# Altium schematic sheet MemoryStorage.SchDoc
size A4; SheetNumber: 7; SheetTotal: 12
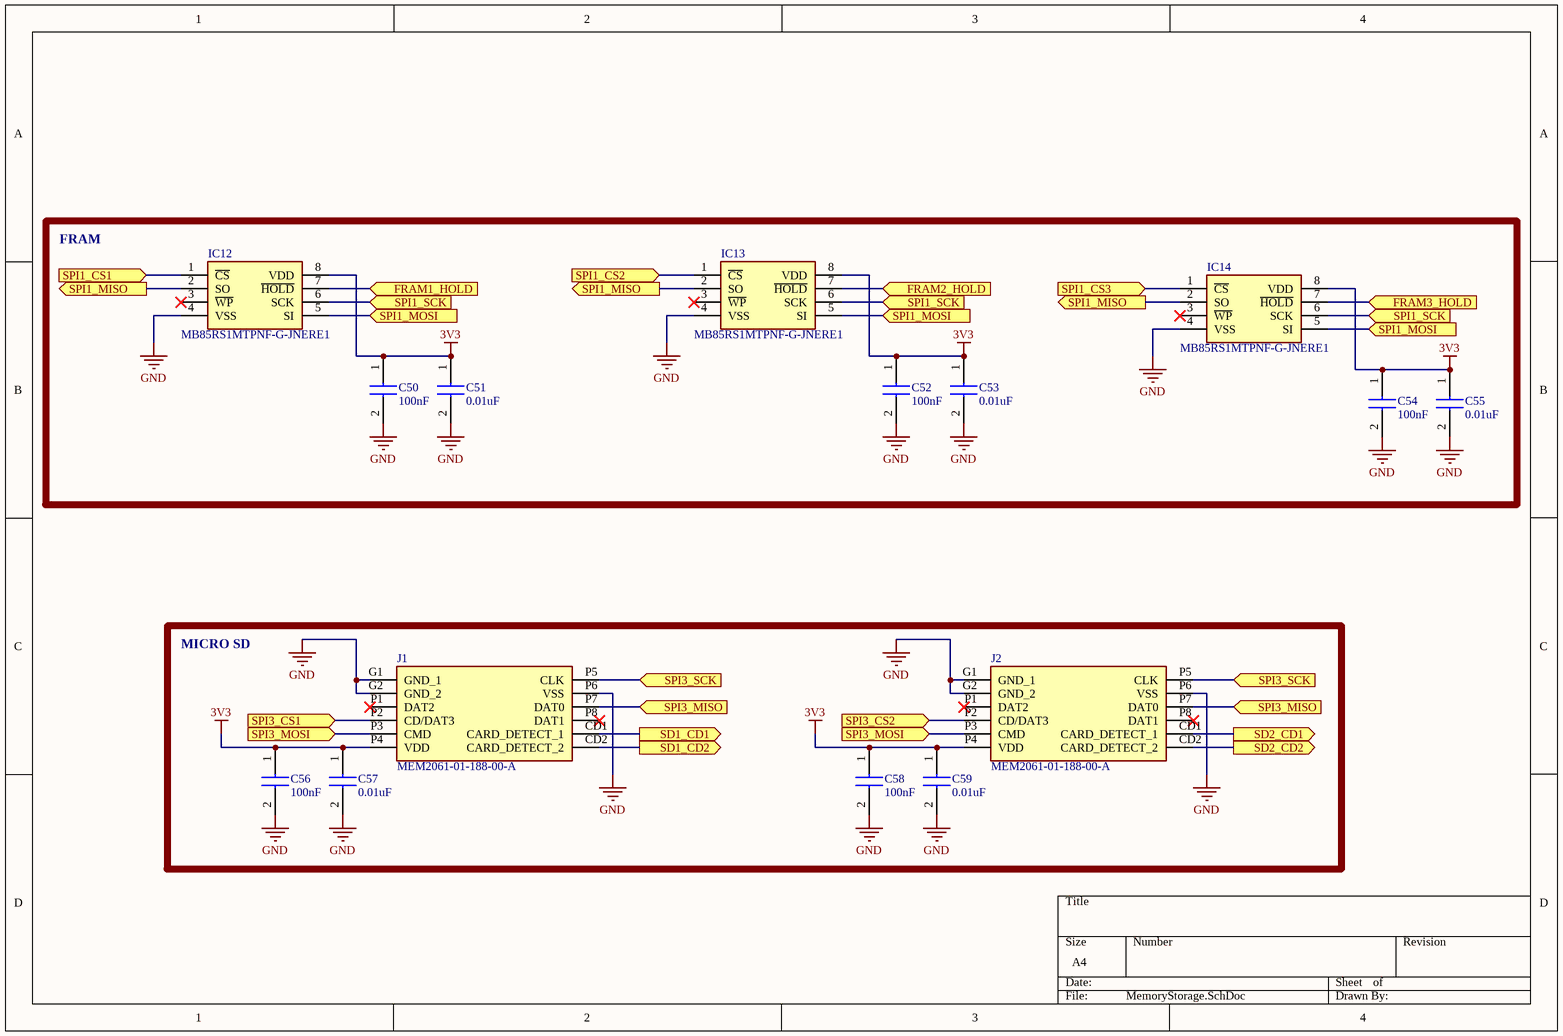
[diagram p0: MemoryStorage.SchDoc]

## Parts
C50  100nF  [CAPC1608X95N]
C51  0.01uF  [C0603]
C52  100nF  [CAPC1608X95N]
C53  0.01uF  [C0603]
C54  100nF  [CAPC1608X95N]
C55  0.01uF  [C0603]
C56  100nF  [CAPC1608X95N]
C57  0.01uF  [C0603]
C58  100nF  [CAPC1608X95N]
C59  0.01uF  [C0603]
IC12  MB85RS1MTPNF-G-JNERE1  [SOIC127P600X175-8N]
IC13  MB85RS1MTPNF-G-JNERE1  [SOIC127P600X175-8N]
IC14  MB85RS1MTPNF-G-JNERE1  [SOIC127P600X175-8N]
J1  MEM2061-01-188-00-A  [MEM20610118800A]
J2  MEM2061-01-188-00-A  [MEM20610118800A]

## Blocks framed on the sheet
FRAM: C50-C55 IC12-IC14
MICRO SD: C56-C59 J1 J2

## Ports
FRAM1_HOLD (in), FRAM2_HOLD (in), FRAM3_HOLD (in), SD1_CD1 (out), SD1_CD2 (out), SD2_CD1 (out), SD2_CD2 (out), SPI1_CS1 (in), SPI1_CS2 (in), SPI1_CS3 (in), SPI1_MISO (out), SPI1_MOSI (in), SPI1_SCK (in), SPI3_CS1 (in), SPI3_CS2 (in), SPI3_MISO (in), SPI3_MOSI (in), SPI3_SCK (in)

## Nets
3V3: C50.1 C51.1 C52.1 C53.1 C54.1 C55.1 C56.1 C57.1 C58.1 C59.1 IC12.8(VDD) IC13.8(VDD) IC14.8(VDD) J1.P4(VDD) J2.P4(VDD)
GND: C50.2 C51.2 C52.2 C53.2 C54.2 C55.2 C56.2 C57.2 C58.2 C59.2 IC12.4(VSS) IC13.4(VSS) IC14.4(VSS) J1.G1(GND_1) J1.G2(GND_2) J1.P6(VSS) J2.G1(GND_1) J2.G2(GND_2) J2.P6(VSS)
FRAM1_HOLD: IC12.7(~{HOLD}) ; port FRAM1_HOLD
FRAM2_HOLD: IC13.7(~{HOLD}) ; port FRAM2_HOLD
FRAM3_HOLD: IC14.7(~{HOLD}) ; port FRAM3_HOLD
SD1_CD1: J1.CD1(CARD_DETECT_1) ; port SD1_CD1
SD1_CD2: J1.CD2(CARD_DETECT_2) ; port SD1_CD2
SD2_CD1: J2.CD1(CARD_DETECT_1) ; port SD2_CD1
SD2_CD2: J2.CD2(CARD_DETECT_2) ; port SD2_CD2
SPI1_CS1: IC12.1(~{CS}) ; port SPI1_CS1
SPI1_CS2: IC13.1(~{CS}) ; port SPI1_CS2
SPI1_CS3: IC14.1(~{CS}) ; port SPI1_CS3
SPI1_MISO: IC12.2(SO) IC13.2(SO) IC14.2(SO) ; port SPI1_MISO
SPI1_MOSI: IC12.5(SI) IC13.5(SI) IC14.5(SI) ; port SPI1_MOSI
SPI1_SCK: IC12.6(SCK) IC13.6(SCK) IC14.6(SCK) ; port SPI1_SCK
SPI3_CS1: J1.P2(CD/DAT3) ; port SPI3_CS1
SPI3_CS2: J2.P2(CD/DAT3) ; port SPI3_CS2
SPI3_MISO: J1.P7(DAT0) J2.P7(DAT0) ; port SPI3_MISO
SPI3_MOSI: J1.P3(CMD) J2.P3(CMD) ; port SPI3_MOSI
SPI3_SCK: J1.P5(CLK) J2.P5(CLK) ; port SPI3_SCK

Not connected (* = marked no-connect by the designer): IC12 3(~{WP})*; IC13 3(~{WP})*; IC14 3(~{WP})*; J1 P1(DAT2)* P8(DAT1)*; J2 P1(DAT2)* P8(DAT1)*

## Library data of the parts
C50 C52 C54 C56 C58 = C0603C104M4RAC7867: 0.1 µF ±20% 16V Ceramic Capacitor X7R 0603 (1608 Metric); Manufacturer_Name: KEMET; Datasheet Link: https://www.arrow.com/en/products/c0603c104m4rac7867/kemet-corporation?region=nac; Height: 0.95mm; Manufacturer_Part_Number: C0603C104M4RAC7867; Mouser Part Number: N/A; Mouser Price/Stock: https://www.mouser.co.uk/ProductDetail/KEMET/C0603C104M4RAC7867?qs=nAEW9fCjKd%252BI998RVtZhZQ%3D%3D; Arrow Part Number: C0603C104M4RAC7867; Arrow Price/Stock: https://www.arrow.com/en/products/c0603c104m4rac7867/kemet-corporation?region=europe
C51 C53 C55 C57 C59 = C0603C103KMRECAUTO: 10000 pF ±10% 63V Ceramic Capacitor X7R 0603 (1608 Metric); Manufacturer_Name: KEMET; Datasheet Link: https://content.kemet.com/datasheets/KEM_C1090_X7R_ESD.pdf; Height: 0.87mm; Manufacturer_Part_Number: C0603C103KMRECAUTO; Mouser Part Number: 80-C0603C103KMREAUTO; Mouser Price/Stock: https://www.mouser.co.uk/ProductDetail/KEMET/C0603C103KMRECAUTO?qs=u4fy%2FsgLU9P0r6p3bzZgfw%3D%3D; Arrow Part Number: C0603C103KMRECAUTO; Arrow Price/Stock: https://www.arrow.com/en/products/c0603c103kmrecauto/kemet-corporation?region=nac
IC12-IC14 = MB85RS1MTPNF-G-JNERE1: FRAM (Ferroelectric RAM) Memory IC 1Mbit SPI 40 MHz 8-SOP; Manufacturer_Name: FUJITSU; Datasheet Link: https://www.fujitsu.com/us/Images/MB85RS1MT-DS501-00022-2v0-E.pdf; Height: 1.75mm; Manufacturer_Part_Number: MB85RS1MTPNF-G-JNERE1; Mouser Part Number: 249-85S1MTPNFGJNERE1; Mouser Price/Stock: https://www.mouser.co.uk/ProductDetail/Fujitsu-Semiconductor/MB85RS1MTPNF-G-JNERE1?qs=HBWAp0VN4Rhzv67G8JdVdQ%3D%3D
J1 J2 = MEM2061-01-188-00-A: MICRO SD PUSH PUSH, CLOSED, SMT,; Manufacturer_Name: GLOBAL CONNECTOR TECHNOLOGY; Datasheet Link: https://gct.co/files/drawings/mem2061.pdf?v=db251ddb-1946-4f24-aa19-b8a17901bdd2; Height: 2.13mm; Manufacturer_Part_Number: MEM2061-01-188-00-A